# EAGLE design pedometer (EAGLE 9.6.2)
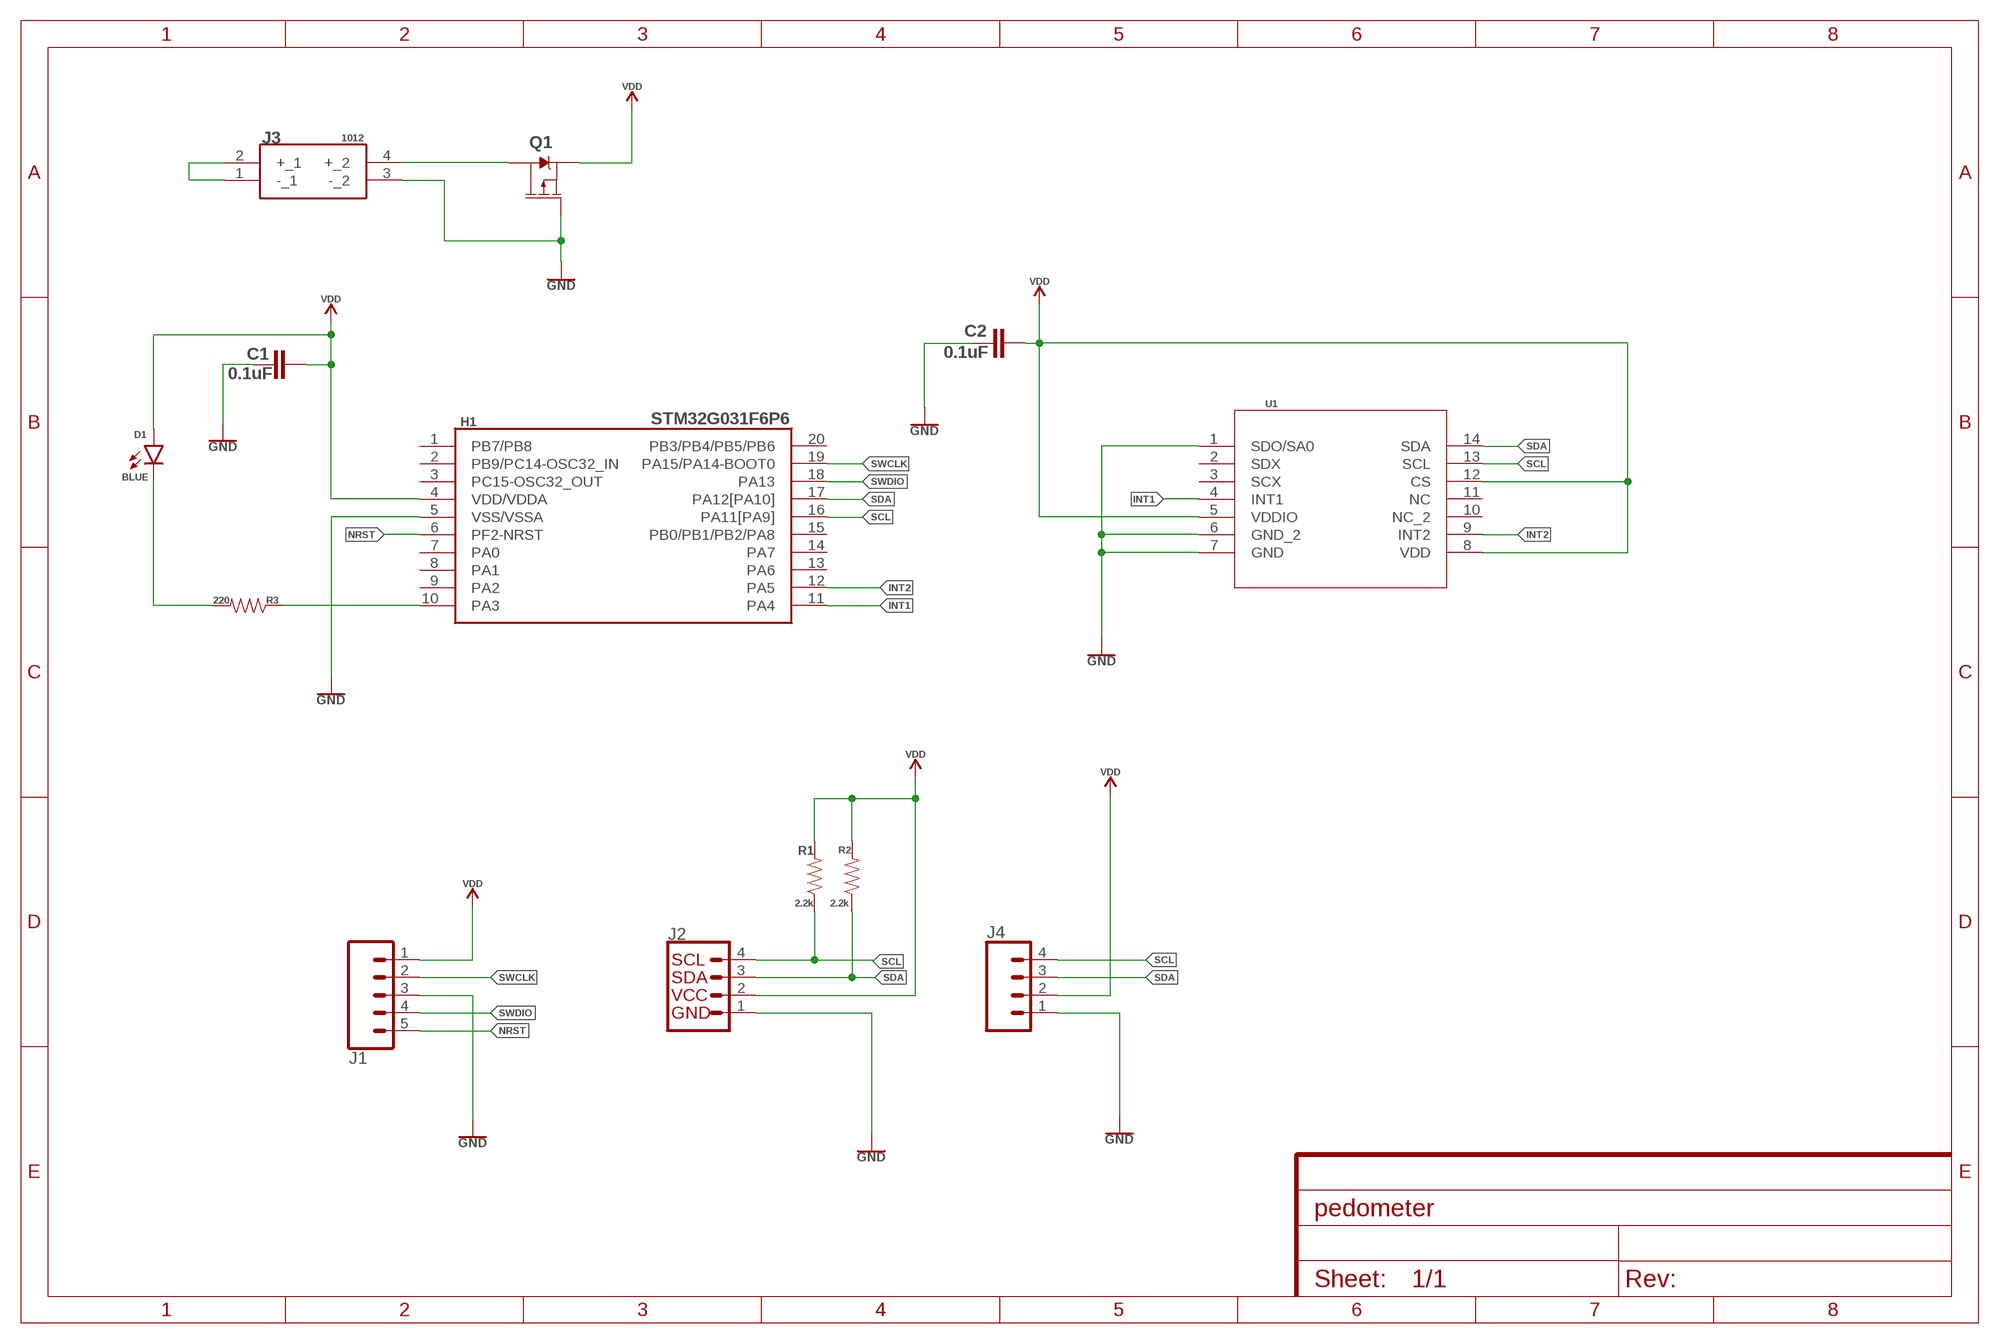
[diagram p0: schematic, sheet 1]

## Parts
C1  0.1uF  0.1UF-0603-25V-(+80/-20%)  [0603]
C2  0.1uF  0.1UF-0603-25V-(+80/-20%)  [0603]
D1  BLUE  LED-BLUE0603  [LED-0603]
H1  STM32G031F6P6  [SOP65P640X120-20N]
J1  CONN_05  [1X05]
J2  QWIIC_CONNECTORJS-1MM  [1X04_1MM_RA]
J3  1012  [1012]
J4  CONN_04  [1X04]
Q1  2.5A/30V/105mΩ  MOSFET_PCH-DMG2307L  [SOT23-3]
R1  2.2k  2.2KOHM-0603-1/10W-1%  [0603]
R2  2.2k  2.2KOHM-0603-1/10W-1%  [0603]
R3  220  220OHM-0603-1/10W-1%  [0603]
U1  LSM6DSO32TRLGA-14L_2P5X3X0P83_STM-M  [LGA-14L_2P5X3X0P83_STM-M]

## Nets
GND: C1.1 C2.1 H1.5(VSS/VSSA) J1.3 J2.1 J3.3(-_2) J4.1(VCC) Q1.1(G) U1.1(SDO/SA0) U1.6(GND_2) U1.7(GND)
INT1: H1.11(PA4) U1.4(INT1)
INT2: H1.12(PA5) U1.9(INT2)
N$1: J3.1(-_1) J3.2(+_1)
N$2: J3.4(+_2) Q1.3(D)
N$3: H1.10(PA3) R3.1
N$4: D1.C R3.2
NRST: H1.6(PF2-NRST) J1.5
SCL: H1.16(PA11[PA9]) J2.4 J4.4(GND) R1.1 U1.13(SCL)
SDA: H1.17(PA12[PA10]) J2.3 J4.3(SDA) R2.1 U1.14(SDA)
SWCLK: H1.19(PA15/PA14-BOOT0) J1.2
SWDIO: H1.18(PA13) J1.4
VDD: C1.2 C2.2 D1.A H1.4(VDD/VDDA) J1.1 J2.2 J4.2(SCL) Q1.2(S) R1.2 R2.2 U1.5(VDDIO) U1.8(VDD) U1.12(CS)
Unconnected: H1.1(PB7/PB8) H1.2(PB9/PC14-OSC32_IN) H1.3(PC15-OSC32_OUT) H1.7(PA0) H1.8(PA1) H1.9(PA2) H1.13(PA6) H1.14(PA7) H1.15(PB0/PB1/PB2/PA8) H1.20(PB3/PB4/PB5/PB6) U1.2(SDX) U1.3(SCX) U1.10(NC_2) U1.11(NC)

## Library data of the parts
C1 C2 = SparkFun-Capacitors:0.1UF: 0.1µF ceramic capacitors A capacitor is a passive two-terminal electrical component used to store electrical energy temporarily in an electric field.; PROD_ID: CAP-00810
D1 = SparkFun-LED:LED-BLUE: Blue SMD LED Used in manufacturing of various products at SparkFun Packages: 0603 - SMD 0603 package [Product Link] <http://www.digikey.com/product-detail/en/SMLE12BC7TT86/511-1589-2-ND/1641808> 1206 - SMD1206 package [Product Link] <http://www.digikey.com/product-detail/en/lite-on-inc/LTST-C150TBKT/160-1643-1-ND/573584> SparkFun Products: ESP8266 Thing-Dev Board <https://www.sparkfun.com/products/13711> RedBoard <https://www.sparkfun.com/products/12757>; PROD_ID: DIO-08575
H1 = SamacSys_Parts:STM32G031F6P6: ARM Microcontrollers - MCU Source: Datasheet <https://rs.componentsearchengine.com/Datasheets/1/STM32G031F6P6.pdf>; DESCRIPTION: ARM Microcontrollers - MCU; HEIGHT: 1.2mm; MANUFACTURER_NAME: STMicroelectronics; MANUFACTURER_PART_NUMBER: STM32G031F6P6; MOUSER_PART_NUMBER: 511-STM32G031F6P6; MOUSER_PRICE-STOCK: https://www.mouser.co.uk/ProductDetail/STMicroelectronics/STM32G031F6P6?qs=uwxL4vQweFMdKaWlN0gXiw%3D%3D
J1 = SparkFun-Connectors:CONN_05: Multi connection point. Often used as Generic Header-pin footprint for 0.1 inch spaced/style header connections On any of the 0.1 inch spaced packages, you can populate with these: Break Away Headers - Straight <https://www.sparkfun.com/products/116> (PRT-00116) Break Away Male Headers - Right Angle <https://www.sparkfun.com/products/553> (PRT-00553) Female Headers <https://www.sparkfun.com/products/115> (PRT-00115) Break Away Headers - Machine Pin <https://www.sparkfun.com/products/117> (PRT-00117) Break Away Female Headers - Swiss Machine Pin <https://www.sparkfun.com/products/743> (PRT-00743) For SCREWTERMINALS and SPRING TERMINALS visit here: Screw Terimnals on SparkFun.com <https://www.sparkfun.com/search/results?term=Screw+Terminals> (5mm/3.5mm/2.54mm spacing) This device is also useful as a general connection point to wire up your design to another part of your project. Our various solder wires solder well into these plated through hole pads. Hook-Up Wire - Assortment (Stranded, 22 AWG) <https://www.sparkfun.com/products/11375> (PRT-11375) Hook-Up Wire - Assortment (Solid Core, 22 AWG) <https://www.sparkfun.com/products/11367> (PRT-11367) View the entire wire category on our website here <https://www.sparkfun.com/categories/141> Special notes: Molex polarized connector foot print use with SKU : PRT-08231 with associated crimp pins and housings. 1MM SMD Version SKU: PRT-10208
J2 = SparkFun-Connectors:QWIIC_CONNECTOR: SparkFun I2C Standard Qwiic Connector An SMD 1mm pitch JST connector makes it easy and quick (get it? Qwiic?) to connect I2C devices to each other. The Qwiic system <http://www.sparkfun.com/qwiic> enables fast and solderless connection between popular platforms and various sensors and actuators. We carry 200mm <https://www.sparkfun.com/products/14204>, 100mm <https://www.sparkfun.com/products/14205>, 50mm <https://www.sparkfun.com/products/14206>, and breadboard friendly <https://www.sparkfun.com/products/14207> Qwiic cables. We also offer 10 pcs strips <https://www.sparkfun.com/products/14323> the SMD connectors.; PROD_ID: CONN-13694
J3 = 1012:1012: Cylindrical Battery Contacts, Clips, Holders & Springs SM BATT HOLDER (2)AA Source: Datasheet <https://www.mouser.com/datasheet/2/215/012-745413.pdf> Check availability <https://pricing.snapeda.com/parts/1012/Keystone%20Electronics/view-part?ref=eda>; AVAILABILITY: In Stock; DESCRIPTION: SMT Holder for AA Battery; MF: Keystone Electronics; MP: 1012; PACKAGE: None; PRICE: None; PURCHASE-URL: https://pricing.snapeda.com/search/part/1012/?ref=eda
J4 = SparkFun-Connectors:CONN_04: Multi connection point. Often used as Generic Header-pin footprint for 0.1 inch spaced/style header connections On any of the 0.1 inch spaced packages, you can populate with these: Break Away Headers - Straight <https://www.sparkfun.com/products/116> (PRT-00116) Break Away Male Headers - Right Angle <https://www.sparkfun.com/products/553> (PRT-00553) Female Headers <https://www.sparkfun.com/products/115> (PRT-00115) Break Away Headers - Machine Pin <https://www.sparkfun.com/products/117> (PRT-00117) Break Away Female Headers - Swiss Machine Pin <https://www.sparkfun.com/products/743> (PRT-00743) For SCREWTERMINALS and SPRING TERMINALS visit here: Screw Terimnals on SparkFun.com <https://www.sparkfun.com/search/results?term=Screw+Terminals> (5mm/3.5mm/2.54mm spacing) This device is also useful as a general connection point to wire up your design to another part of your project. Our various solder wires solder well into these plated through hole pads. Hook-Up Wire - Assortment (Stranded, 22 AWG) <https://www.sparkfun.com/products/11375> (PRT-11375) Hook-Up Wire - Assortment (Solid Core, 22 AWG) <https://www.sparkfun.com/products/11367> (PRT-11367) View the entire wire category on our website here <https://www.sparkfun.com/categories/141> Special notes: Molex polarized connector foot print use with SKU : PRT-08231 with associated crimp pins and housings. 1MM SMD Version SKU: PRT-10208; PROD_ID: CONN-09696
Q1 = SparkFun-DiscreteSemi:MOSFET_PCH: P-channel MOSFETs Voltage controlled devices that allow control of high current outputs. SparkFun Products: SparkFun ESP32 Thing <https://www.sparkfun.com/products/13907> SparkFun ESP8266 Thing <https://www.sparkfun.com/products/13231>; PROD_ID: TRANS-11308
R1 R2 = SparkFun-Resistors:2.2KOHM: 2.2kΩ resistor A resistor is a passive two-terminal electrical component that implements electrical resistance as a circuit element. Resistors act to reduce current flow, and, at the same time, act to lower voltage levels within circuits. - Wikipedia; PROD_ID: RES-08272
R3 = SparkFun-Resistors:220OHM: 220Ω resistor A resistor is a passive two-terminal electrical component that implements electrical resistance as a circuit element. Resistors act to reduce current flow, and, at the same time, act to lower voltage levels within circuits. - Wikipedia; PROD_ID: RES-07861
U1 = LSM6DSO32:LSM6DSO32TR; COPYRIGHT: Copyright (C) 2022 Ultra Librarian. All rights reserved.; MANUFACTURER_PART_NUMBER: LSM6DSO32TR; MFR_NAME: STMicroelectronics

## Board
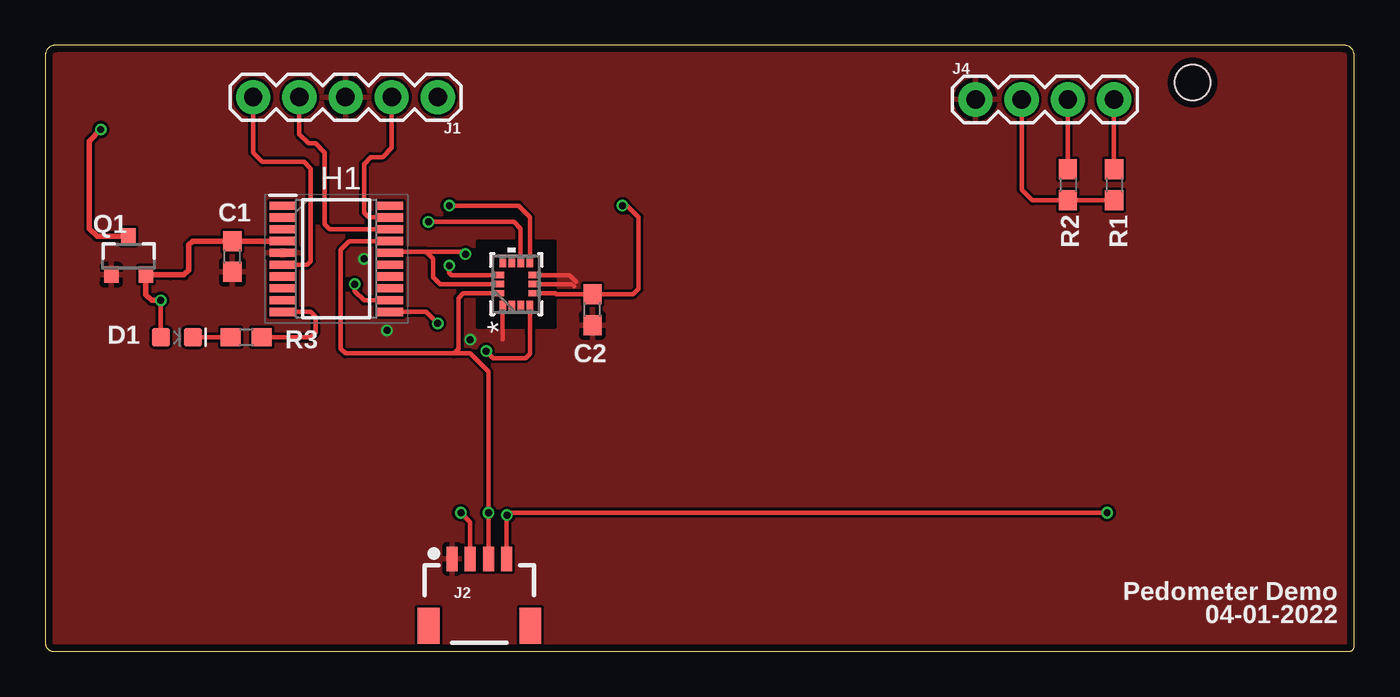
[diagram p1: board, top side]
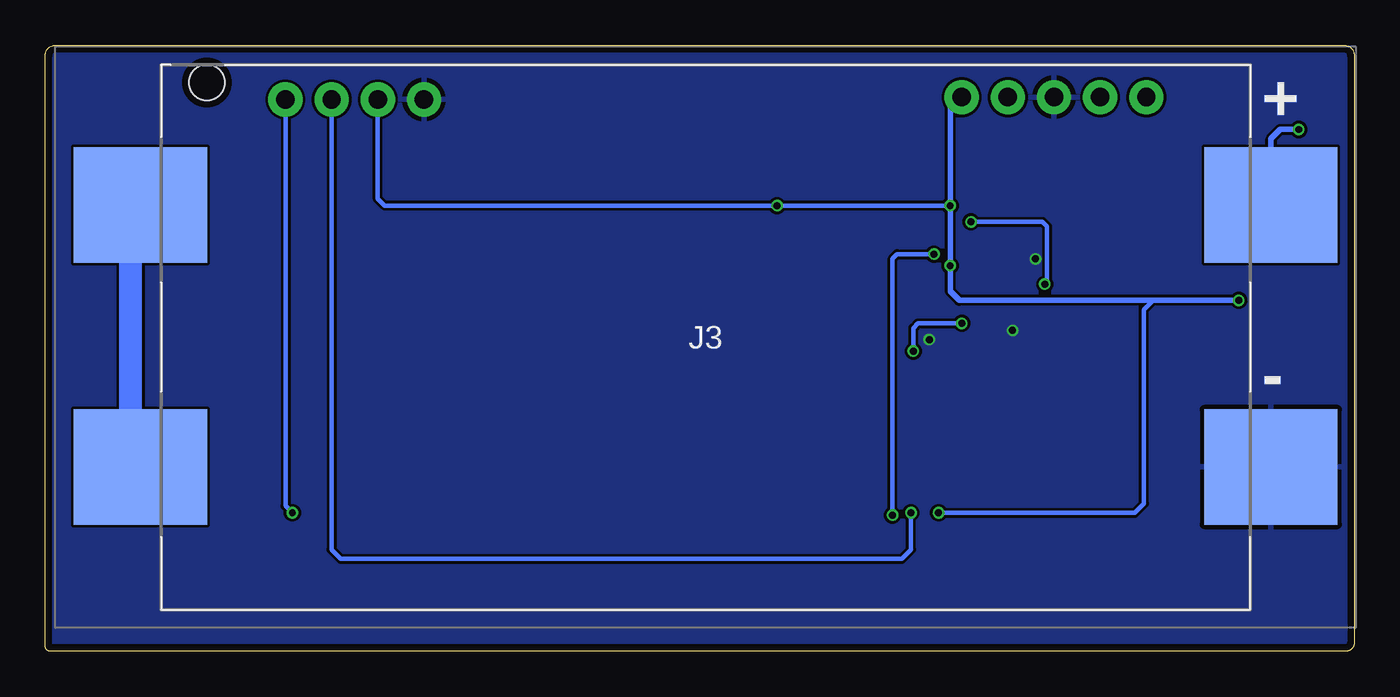
[diagram p2: board, bottom side, seen from below]

Size 72.01 x 33.32 mm. Coordinates in mm from the lower left corner, seen from the top.
Outline: 71.49,33.33 0.52,33.33 arc90 0,32.81 0,0.43 arc90 0.43,0 71.75,0 arc90 72.01,0.25 72.01,32.81 arc90 71.49,33.33
Copper layers (1*16): Top 0.035559375mm / dielectric 1.6mm / Bottom 0.035559375mm
Design rules "oshpark-2layer": minimum track width 6mil, minimum drill 10mil, track to track 6mil, track to pad 6mil, pad to pad 6mil, via to via 6mil, smd to smd 6mil, copper to edge 15mil, drill to drill 6mil, minimum pad ring 5mil, minimum via ring 5mil, stop-mask expansion 2.5mil, vias tented up to drill 0mil, thermal gap 10mil

### Footprints (pad centres in the part's own frame; a part is rotated, then mirrored left to right if it is on the bottom)
0603 = smd 1.1 x 1: 1 -0.85,0; 2 0.85,0
LED-0603 = smd 1 x 1: A -0.877,0; C 0.877,0
SOP65P640X120-20N = smd 1.475 x 0.45: 1 -2.938,2.925; 2 -2.938,2.275; 3 -2.938,1.625; 4 -2.938,0.975; 5 -2.938,0.325; 6 -2.938,-0.325; 7 -2.938,-0.975; 8 -2.938,-1.625; 9 -2.938,-2.275; 10 -2.938,-2.925; 11 2.938,-2.925; 12 2.938,-2.275; 13 2.938,-1.625; 14 2.938,-0.975; 15 2.938,-0.325; 16 2.938,0.325; 17 2.938,0.975; 18 2.938,1.625; 19 2.938,2.275; 20 2.938,2.925
1X05 = drill 1.016 pad 1.88: 1 0,0; 2 2.54,0; 3 5.08,0; 4 7.62,0; 5 10.16,0
1X04_1MM_RA = smd 0.6 x 1.35: 1 -1.5,0; 2 -0.5,0; 3 0.5,0; 4 1.5,0 | smd 1.2 x 2: NC1 2.8,-3.675; NC2 -2.8,-3.675
1012 = smd 7.34 x 6.35: 1 -31.105,7.285; 2 -31.105,-7.135; 3 31.105,-7.135; 4 31.105,7.285 | hole 1.98: -27.435,14.015
1X04 = drill 1.016 pad 1.88: 1 0,0; 2 2.54,0; 3 5.08,0; 4 7.62,0
SOT23-3 = smd 0.8 x 0.9: 1 -0.95,-1; 2 0.95,-1; 3 0,1.1
LGA-14L_2P5X3X0P83_STM-M = smd 0.577 x 0.352: 1 -1.21,0.75; 2 -1.21,0.25; 3 -1.21,-0.25; 4 -1.21,-0.75; 8 1.21,-0.75; 9 1.21,-0.25; 10 1.21,0.25; 11 1.21,0.75 | smd 0.352 x 0.577: 5 -0.5,-0.956; 6 0,-0.956; 7 0.5,-0.956; 12 0.5,0.956; 13 0,0.956; 14 -0.5,0.956

### Placement (x,y rotation side)
C1  10.29,21.72 90 top
C2  30.1,18.8 90 top
D1  7.24,17.27 0 top
H1  16,21.59 0 top
J1  21.59,30.48 180 top
J2  23.88,5.08 0 top
J3  35.69,17.27 0 bottom
J4  51.18,30.35 0 top
Q1  4.57,21.72 0 top
R1  58.8,25.65 270 top
R2  56.26,25.65 270 top
R3  11.05,17.27 180 top
U1  25.91,20.19 90 top

### Tracks (layer width: path | path; a pad name or v marks a point on that pad's centre or on a via)
GND  (via drill 0.38)
  Top 0.254: U1.1 25.16,17.16 | U1.6 28.96,20.19 29.08,20.07 | U1.7 28.84,20.69 29.21,20.32
  other vias: 17.53,21.59 18.8,17.65 23.37,17.14
  pour Top (rank 6): -0.89,-0.76 -0.89,32 2.54,35.43 73.79,35.43 73.79,2.16 70.87,-0.76
  pour Bottom (rank 6): -0.89,-0.76 -0.89,33.02 72.39,33.02 72.39,-0.76
INT1  (via drill 0.38)
  Top 0.254: H1.11 20.96,18.66 v21.59,18.03 | U1.4 26.66,17.78 26.66,17.51 26.66,16.37 26.42,16.13 24.64,16.13 v24.26,16.51
  Bottom 0.254: v24.26,16.51 24.26,17.78 24,18.03 v21.59,18.03
INT2  (via drill 0.38)
  Top 0.254: U1.9 26.16,23.25 25.78,23.62 v21.08,23.62 | v17.02,20.19 17.02,19.81 17.53,19.3 18.93,19.3 H1.12
  Bottom 0.254: v21.08,23.62 17.14,23.62 16.89,23.37 16.89,20.32 v17.02,20.19
N$1
  Bottom 0.254: J3.2 66.81,10.16 67.31,10.16
  Bottom 1.27: J3.1 67.31,24.04 67.31,10.16
N$2  (via drill 0.38)
  Top 0.305: v3.05,28.7 2.41,28.07 2.41,23.24 2.84,22.82 Q1.3
  Bottom 0.305: J3.4 4.58,28.18 4.06,28.7 v3.05,28.7
N$3
  Top 0.254: R3.1 14.61,17.27 14.86,17.53 14.86,18.41 14.61,18.67 H1.10
N$4
  Top 0.254: D1.C R3.2
NRST
  Top 0.254: H1.6 14.41,21.27 14.61,21.46 14.61,26.54 14.22,26.92 11.94,26.92 11.43,27.43 J1.5
SCL  (via drill 0.38)
  Top 0.254: U1.13 21.72,20.19 21.34,20.57 21.34,21.59 20.95,21.97 | H1.16 19,21.97 20.95,21.97 | J2.4 25.38,7.47 v25.4,7.49 25.53,7.62 v58.42,7.62 | 20.95,21.97 22.99,21.97 v23.11,21.84 | R1.1 J4.4
  Bottom 0.254: v25.4,7.49 25.4,21.59 25.15,21.84 v23.11,21.84 | J4.4 58.8,8 v58.42,7.62
SDA  (via drill 0.38)
  Top 0.254: U1.14 23,19.69 22.73,19.43 22.73,16.64 22.48,16.38 | 22.48,16.38 16.51,16.38 16.26,16.64 16.26,22.1 16.72,22.57 H1.17 | J2.3 v24.38,7.62 24.38,15.38 23.37,16.38 22.48,16.38 | R2.1 J4.3
  Bottom 0.254: J4.3 56.26,5.59 55.75,5.08 24.89,5.08 24.38,5.59 v24.38,7.61 v24.38,7.62
SWCLK
  Top 0.254: H1.19 17.79,23.86 17.53,24.13 17.53,26.8 17.91,27.18 18.54,27.18 19.05,27.69 J1.2
SWDIO
  Top 0.254: H1.18 15.65,23.21 15.37,23.5 15.37,27.43 14.86,27.94 14.48,27.94 13.97,28.45 J1.4
VDD  (via drill 0.38)
  Top 0.254: U1.12 22.36,20.69 22.23,20.83 v22.23,21.21 | U1.5 28.06,19.69 28.11,19.65 C2.2 32.35,19.65 32.64,19.94 32.64,23.88 32,24.51 v31.75,24.51 | J2.2 23.38,7.1 v22.86,7.62 | U1.8 26.66,23.89 26.04,24.51 v22.23,24.51 | D1.A 6.35,17.28 v6.35,19.3 | R1.2 R2.2 54.32,24.8 53.72,25.4 J4.2
  Top 0.305: H1.4 C1.2 8.09,22.57 7.87,22.35 7.87,20.95 7.62,20.7 6.89,20.7 6.87,20.72 Q1.2 5.52,19.62 5.84,19.3 v6.35,19.3
  Bottom 0.254: v22.86,7.62 12.06,7.62 11.56,8.13 11.56,18.8 11.05,19.3 | v22.23,24.51 v31.75,24.51 53.34,24.51 53.72,24.89 J4.2
  Bottom 0.305: v6.35,19.3 11.05,19.3 21.72,19.3 22.23,19.81 v22.23,21.21 v22.23,24.51 22.23,29.84 J1.1

### Text on the board
tNames: Pedometer Demo | 04-01-2022
bNames: + | -